# EAGLE design Printhead_board (EAGLE 9.3.0)
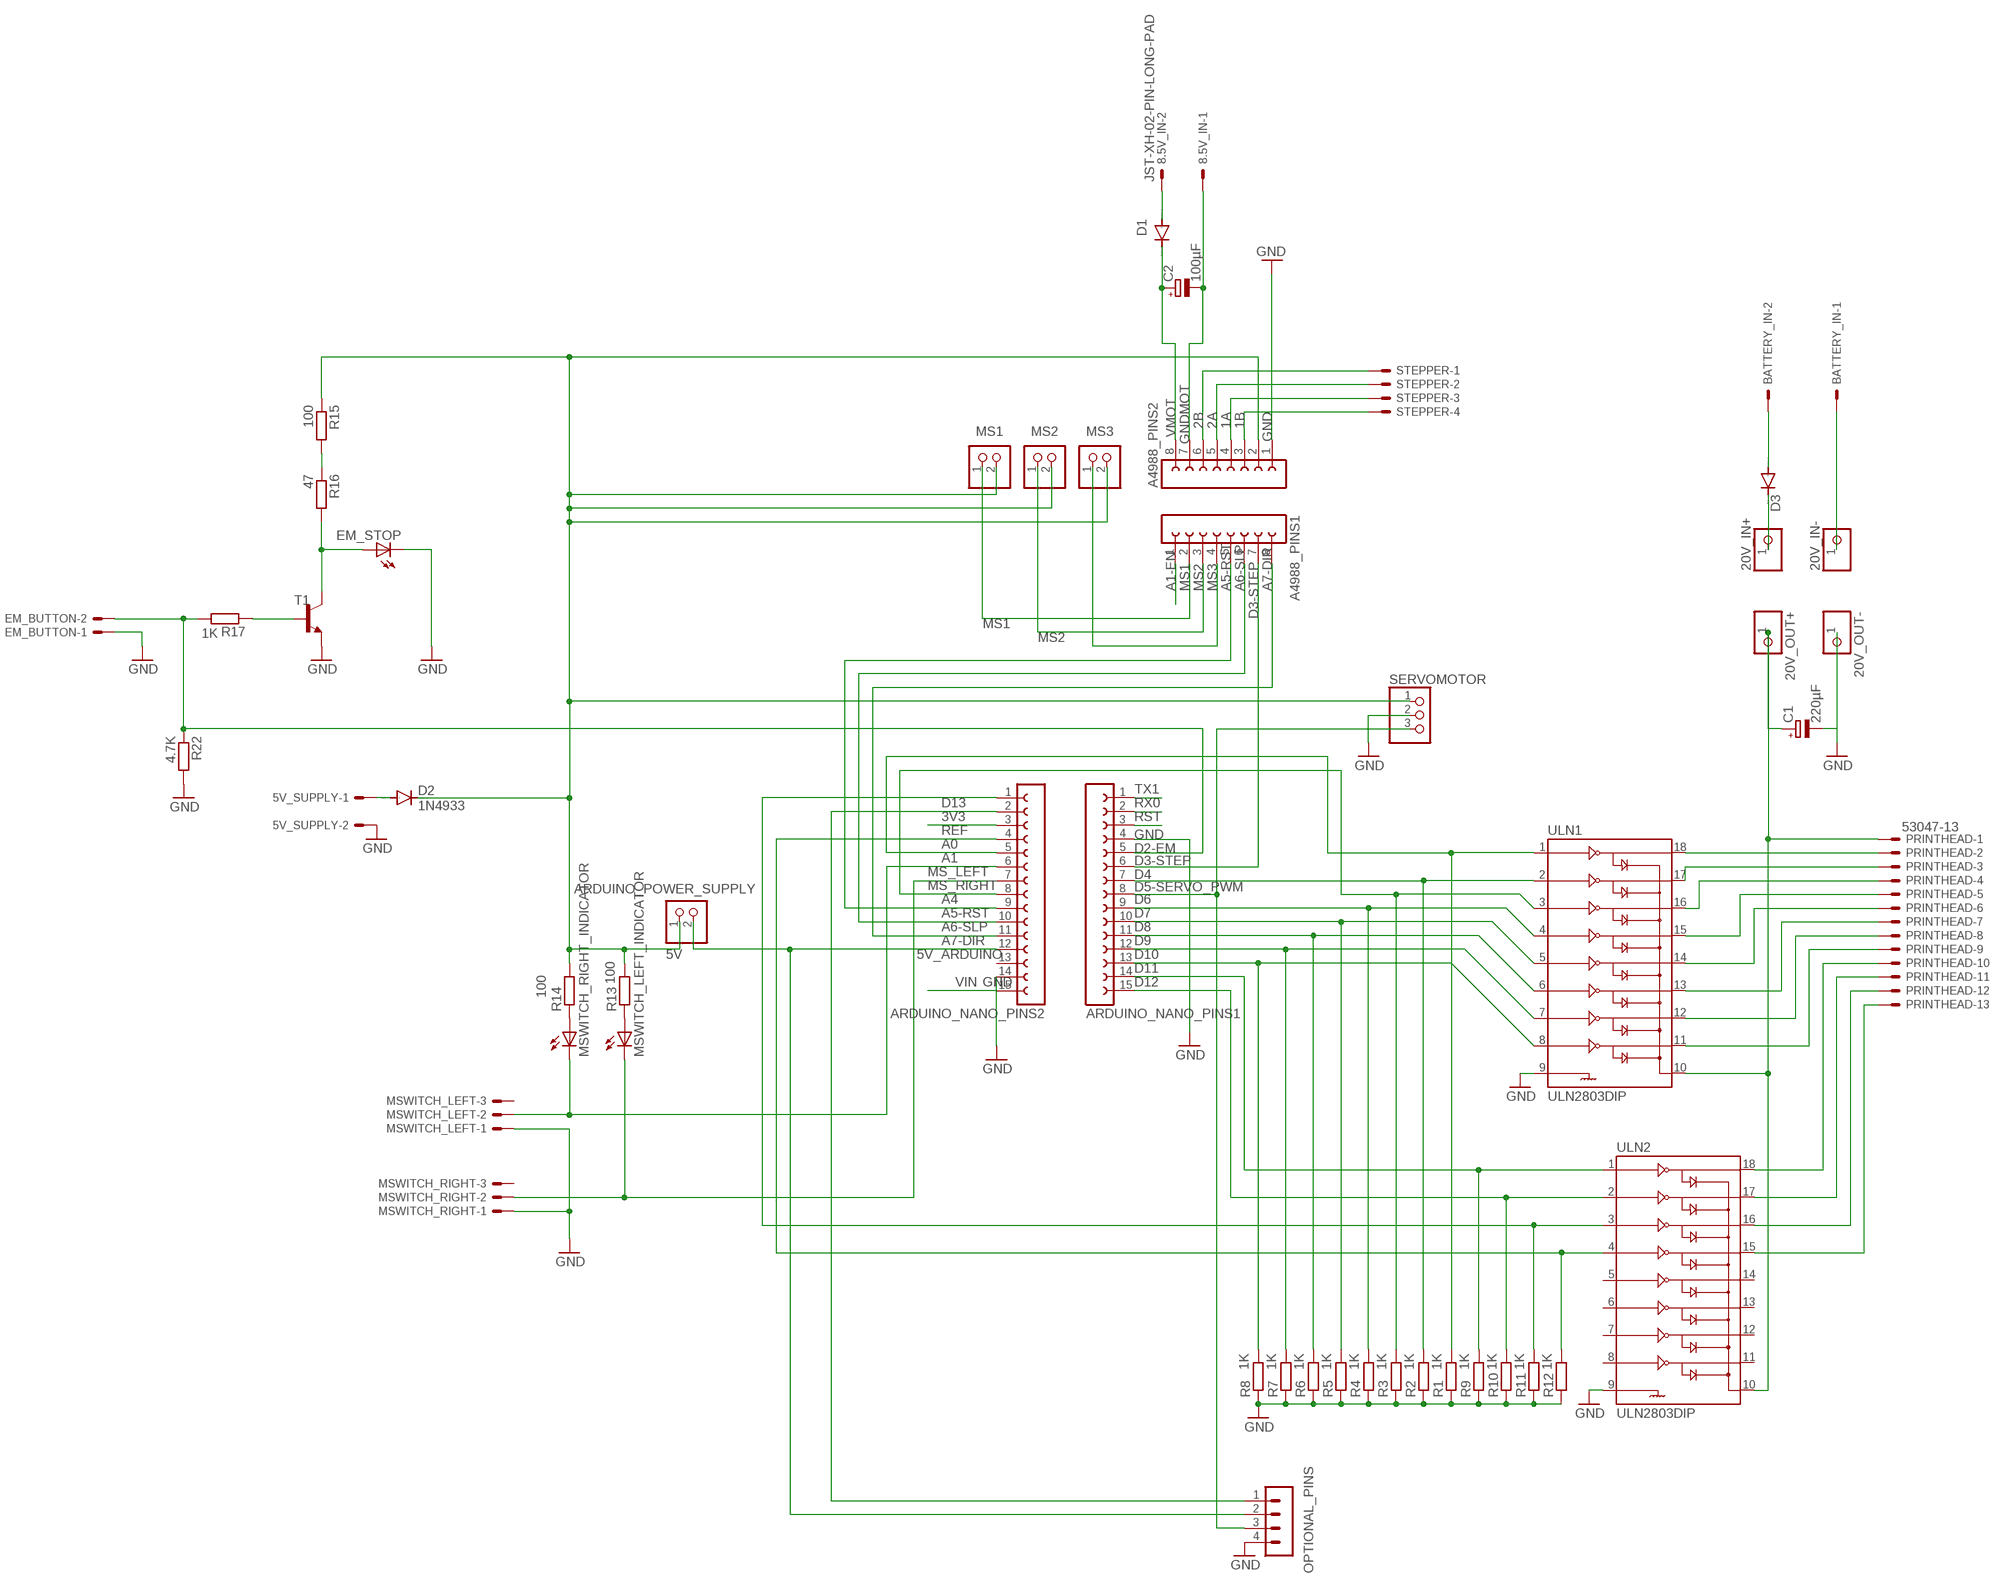
[diagram p0: schematic, sheet 1]

## Parts
5V_SUPPLY  JST-XH-02-PIN-LONG-PAD  [JST-XH-02-PACKAGE-LONG-PAD]
8.5V_IN  JST-XH-02-PIN-LONG-PAD  [JST-XH-02-PACKAGE-LONG-PAD]
20V_IN+  PINHD-1X1  [1X01]
20V_IN-  PINHD-1X1  [1X01]
20V_OUT+  PINHD-1X1  [1X01]
20V_OUT-  PINHD-1X1  [1X01]
A4988_PINS1  FE08-1  [FE08]
A4988_PINS2  FE08-1  [FE08]
ARDUINO_NANO_PINS1  FE15-1  [FE15]
ARDUINO_NANO_PINS2  FE15-1  [FE15]
ARDUINO_POWER_SUPPLY  PINHD-1X2  [1X02]
BATTERY_IN  JST-XH-02-PIN-ROUND-PAD  [JST-XH-02-PACKAGE-ROUND-PAD]
C1  220µF  CPOL-EUE5-10.5  [E5-10,5]
C2  100µF  CPOL-EUSANYO_E  [SANYO-OSCON_E]
D1  DIODE-DO15-12  [DO15-12]
D2  1N4933  [DO41-10]
D3  DIODE-DO201-15  [DO201-15]
EM_BUTTON  JST-XH-02-PIN-LONG-PAD  [JST-XH-02-PACKAGE-LONG-PAD]
EM_STOP  LED5MM  [LED5MM]
MS1  PINHD-1X2  [1X02]
MS2  PINHD-1X2  [1X02]
MS3  PINHD-1X2  [1X02]
MSWITCH_LEFT  JST-XH-03-PIN-LONG-PAD  [JST-XH-03-PACKAGE-LONG-PAD]
MSWITCH_LEFT_INDICATOR  LED5MM  [LED5MM]
MSWITCH_RIGHT  JST-XH-03-PIN-LONG-PAD  [JST-XH-03-PACKAGE-LONG-PAD]
MSWITCH_RIGHT_INDICATOR  LED5MM  [LED5MM]
OPTIONAL_PINS  MA04-1  [MA04-1]
PRINTHEAD  53047-13  [53047-13]
R1  1K  R-EU_0207/7  [0207/7]
R2  1K  R-EU_0207/7  [0207/7]
R3  1K  R-EU_0207/7  [0207/7]
R4  1K  R-EU_0207/7  [0207/7]
R5  1K  R-EU_0207/7  [0207/7]
R6  1K  R-EU_0207/7  [0207/7]
R7  1K  R-EU_0207/7  [0207/7]
R8  1K  R-EU_0207/7  [0207/7]
R9  1K  R-EU_0207/7  [0207/7]
R10  1K  R-EU_0207/7  [0207/7]
R11  1K  R-EU_0207/7  [0207/7]
R12  1K  R-EU_0207/7  [0207/7]
R13  100  R-EU_0207/7  [0207/7]
R14  100  R-EU_0207/7  [0207/7]
R15  100  R-EU_0207/7  [0207/7]
R16  47  R-EU_0207/7  [0207/7]
R17  1K  R-EU_0207/7  [0207/7]
R22  4.7K  R-EU_0207/7  [0207/7]
SERVOMOTOR  PINHD-1X3  [1X03]
STEPPER  JST-XH-04-PIN-LONG-PAD  [JST-XH-04-PACKAGE-LONG-PAD]
T1  2N2222  [TO92-EBC-OVAL]
ULN1  ULN2803DIP  [DIL18]
ULN2  ULN2803DIP  [DIL18]

## Nets
1A: A4988_PINS2.4 STEPPER.3
1B: A4988_PINS2.3 STEPPER.4
2A: A4988_PINS2.5 STEPPER.2
2B: A4988_PINS2.6 STEPPER.1
3V3: ARDUINO_NANO_PINS2.2 OPTIONAL_PINS.1
5V: A4988_PINS2.2 ARDUINO_POWER_SUPPLY.1 D2.C MS1.2 MS2.2 MS3.2 R13.2 R14.2 R15.1 SERVOMOTOR.1
5V_ARDUINO: ARDUINO_NANO_PINS2.12 ARDUINO_POWER_SUPPLY.2 OPTIONAL_PINS.2
A0: ARDUINO_NANO_PINS2.4 R12.2 ULN2.4
A1: ARDUINO_NANO_PINS2.5 R1.2 ULN1.1
A1-EN: A4988_PINS1.1
A4: ARDUINO_NANO_PINS2.8 R3.2 ULN1.3
A5-RST: A4988_PINS1.5 ARDUINO_NANO_PINS2.9
A6-SLP: A4988_PINS1.6 ARDUINO_NANO_PINS2.10
A7-DIR: A4988_PINS1.8 ARDUINO_NANO_PINS2.11
D2-EM: ARDUINO_NANO_PINS1.5 EM_BUTTON.2 R17.2 R22.1
D3-STEP: A4988_PINS1.7 ARDUINO_NANO_PINS1.6
D4: ARDUINO_NANO_PINS1.7 R2.2 ULN1.2
D5-SERVO_PWM: ARDUINO_NANO_PINS1.8 OPTIONAL_PINS.3 SERVOMOTOR.3
D6: ARDUINO_NANO_PINS1.9 R4.2 ULN1.4
D7: ARDUINO_NANO_PINS1.10 R5.2 ULN1.5
D8: ARDUINO_NANO_PINS1.11 R6.2 ULN1.6
D9: ARDUINO_NANO_PINS1.12 R7.2 ULN1.7
D10: ARDUINO_NANO_PINS1.13 R8.2 ULN1.8
D11: ARDUINO_NANO_PINS1.14 R9.2 ULN2.1
D12: ARDUINO_NANO_PINS1.15 R10.2 ULN2.2
D13: ARDUINO_NANO_PINS2.1 R11.2 ULN2.3
GND: 5V_SUPPLY.2 20V_OUT-.1 A4988_PINS2.1 ARDUINO_NANO_PINS1.4 ARDUINO_NANO_PINS2.14 C1.- EM_BUTTON.1 EM_STOP.K(C) MSWITCH_LEFT.1 MSWITCH_RIGHT.1 OPTIONAL_PINS.4 R1.1 R2.1 R3.1 R4.1 R5.1 R6.1 R7.1 R8.1 R9.1 R10.1 R11.1 R12.1 R22.2 SERVOMOTOR.2 T1.E ULN1.9 ULN2.9
GNDMOT [Large]: 8.5V_IN.1 A4988_PINS2.7 C2.-
MS1: A4988_PINS1.2 MS1.1
MS2: A4988_PINS1.3 MS2.1
MS3: A4988_PINS1.4 MS3.1
MS_LEFT: ARDUINO_NANO_PINS2.6 MSWITCH_LEFT.2 MSWITCH_RIGHT_INDICATOR.K(C)
MS_RIGHT: ARDUINO_NANO_PINS2.7 MSWITCH_LEFT_INDICATOR.K(C) MSWITCH_RIGHT.2
N1: PRINTHEAD.2 ULN1.18
N12: PRINTHEAD.13 ULN2.15
N$2: EM_STOP.A R16.2 T1.C
N$3: R17.1 T1.B
N$9: R15.2 R16.1
N$13 [VryLarge]: BATTERY_IN.2 D3.A
N$17: 5V_SUPPLY.1 D2.A
N$18: PRINTHEAD.3 ULN1.17
N$19: PRINTHEAD.4 ULN1.16
N$20: PRINTHEAD.5 ULN1.15
N$21: PRINTHEAD.6 ULN1.14
N$22: PRINTHEAD.7 ULN1.13
N$23: PRINTHEAD.8 ULN1.12
N$24: PRINTHEAD.9 ULN1.11
N$25: PRINTHEAD.10 ULN2.18
N$26: PRINTHEAD.11 ULN2.17
N$27: PRINTHEAD.12 ULN2.16
N$28 [Large]: 8.5V_IN.2 D1.A
N$29: MSWITCH_LEFT_INDICATOR.A R13.1
N$30: MSWITCH_RIGHT_INDICATOR.A R14.1
N$31 [VryLarge]: 20V_IN-.1 BATTERY_IN.1
N$32: 20V_OUT+.1 C1.+ PRINTHEAD.1 ULN1.10 ULN2.10
N$33 [VryLarge]: 20V_IN+.1 D3.C
REF: ARDUINO_NANO_PINS2.3
RST: ARDUINO_NANO_PINS1.3
RX0: ARDUINO_NANO_PINS1.2
TX1: ARDUINO_NANO_PINS1.1
VIN: ARDUINO_NANO_PINS2.15
VMOT [Large]: A4988_PINS2.8 C2.+ D1.C
Unconnected: ARDUINO_NANO_PINS2.13 MSWITCH_LEFT.3 MSWITCH_RIGHT.3 ULN2.5 ULN2.6 ULN2.7 ULN2.8 ULN2.11 ULN2.12 ULN2.13 ULN2.14

## Library data of the parts
5V_SUPPLY 8.5V_IN BATTERY_IN EM_BUTTON = Rembrandt Electronics - JST XH Connectors v1-0:JST-XH-02-PIN: JST XH Connector 2 Pin Wire to board connector. Pitch: 2,54 mm, (0.100") Number of pins: 2 Created by Rembrandt Electronics www.rembrandtelectronics.com
20V_IN+ 20V_IN- 20V_OUT+ 20V_OUT- = adafruit:PINHD-1X1: Pin header 1x1 for 0.1" spacing With round pins
A4988_PINS1 A4988_PINS2 = con-lsta:FE08-1: FEMALE HEADER; OC_FARNELL: unknown; OC_NEWARK: unknown
ARDUINO_NANO_PINS1 ARDUINO_NANO_PINS2 = con-lsta:FE15-1: FEMALE HEADER; OC_FARNELL: unknown; OC_NEWARK: unknown
ARDUINO_POWER_SUPPLY MS1-MS3 = pinhead:PINHD-1X2: PIN HEADER
C1 C2 = rcl:CPOL-EU: POLARIZED CAPACITOR, European symbol; SPICEPREFIX: C
D1 D3 = diode:DIODE-: DIODE
D2 = diode:1N4933: DIODE fast recovery rectifier, 1A
EM_STOP MSWITCH_LEFT_INDICATOR MSWITCH_RIGHT_INDICATOR = adafruit:LED: LED OSRAM: - CHIPLED LG R971, LG N971, LY N971, LG Q971, LY Q971, LO R971, LY R971 LH N974, LH R974 LS Q976, LO Q976, LY Q976 LO Q996 - Hyper CHIPLED LW Q18S LB Q993, LB Q99A, LB R99A - SideLED LS A670, LO A670, LY A670, LG A670, LP A670 LB A673, LV A673, LT A673, LW A673 LH A674 LY A675 LS A676, LA A676, LO A676, LY A676, LW A676 LS A679, LY A679, LG A679 - Hyper Micro SIDELED® LS Y876, LA Y876, LO Y876, LY Y876 LT Y87S - SmartLED LW L88C, LW L88S LB L89C, LB L89S, LG L890 LS L89K, LO L89K, LY L89K LS L896, LA L896, LO L896, LY L896 - TOPLED LS T670, LO T670, LY T670, LG T670, LP T670 LSG T670, LSP T670, LSY T670, LOP T670, LYG T670 LG T671, LOG T671, LSG T671 LB T673, LV T673, LT T673, LW T673 LH T674 LS T676, LA T676, LO T676, LY T676, LB T676, LH T676, LSB T676, LW T676 LB T67C, LV T67C, LT T67C, LS T67K, LO T67K, LY T67K, LW E67C LS E67B, LA E67B, LO E67B, LY E67B, LB E67C, LV E67C, LT E67C LW T67C LS T679, LY T679, LG T679 LS T770, LO T770, LY T770, LG T770, LP T770 LB T773, LV T773, LT T773, LW T773 LH T774 LS E675, LA E675, LY E675, LS T675 LS T776, LA T776, LO T776, LY T776, LB T776 LHGB T686 LT T68C, LB T68C - Hyper Mini TOPLED® LB M676 - Mini TOPLED Santana® LG M470 LS M47K, LO M47K, LY M47K Source: http://www.osram.convergy.de/
MSWITCH_LEFT MSWITCH_RIGHT = Rembrandt Electronics - JST XH Connectors v1-0:JST-XH-03-PIN: JST XH Connector 2 Pin Wire to board connector. Pitch: 2,54 mm, (0.100") Number of pins: 3 Created by Rembrandt Electronics www.rembrandtelectronics.com
OPTIONAL_PINS = con-lstb:MA04-1: PIN HEADER; OC_FARNELL: unknown; OC_NEWARK: unknown
PRINTHEAD = con-molex:53?-13: CONNECTOR wire to board 1.25 mm (.049 inch) pitch header; MF: MOLEX; MPN: 53047-1310-C; OC_FARNELL: 1012238; OC_NEWARK: 03N7646
R1-R17 R22 = rcl:R-EU_: RESISTOR, European symbol; SPICEPREFIX: R
SERVOMOTOR = adafruit:PINHD-1X3: PIN HEADER
STEPPER = Rembrandt Electronics - JST XH Connectors v1-0:JST-XH-04-PIN: JST XH Connector 2 Pin Wire to board connector. Pitch: 2,54 mm, (0.100") Number of pins: 4 Created by Rembrandt Electronics www.rembrandtelectronics.com
T1 = adafruit:2N2222: NPN TRANSISTOR Big oval pads
ULN1 ULN2 = uln2803:ULN2803: Darlington Driver(IC-07959, low stock) ULN2803 Darlington array. 500mA max per channel, 8-channel package. Spark Fun Electronics SKU : COM-00312; AVAILABILITY: Unavailable; MF: STMicroelectronics; MP: ULN2803; PACKAGE: DIP-18 STMicroelectronics; PRICE: None

## Net classes
0 1B: width 0.3 mm
1 Large: width 1 mm, drill 0.65 mm
2 VryLarge: width 1.5 mm, drill 0.8 mm

## Board
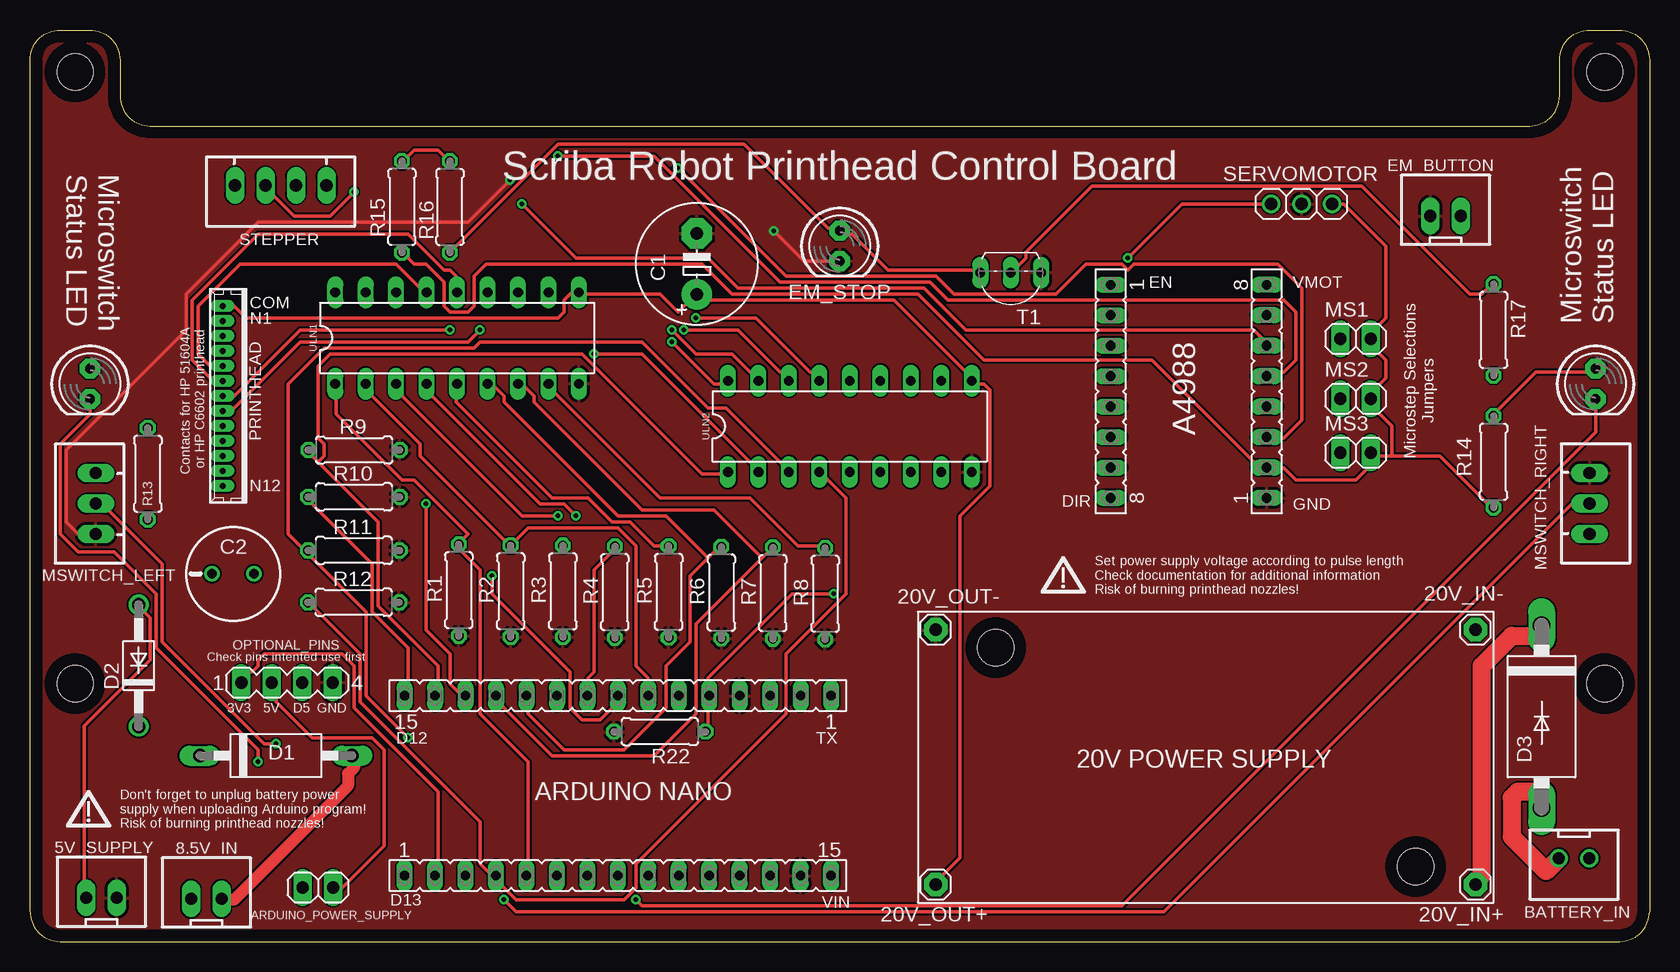
[diagram p1: board, top side]
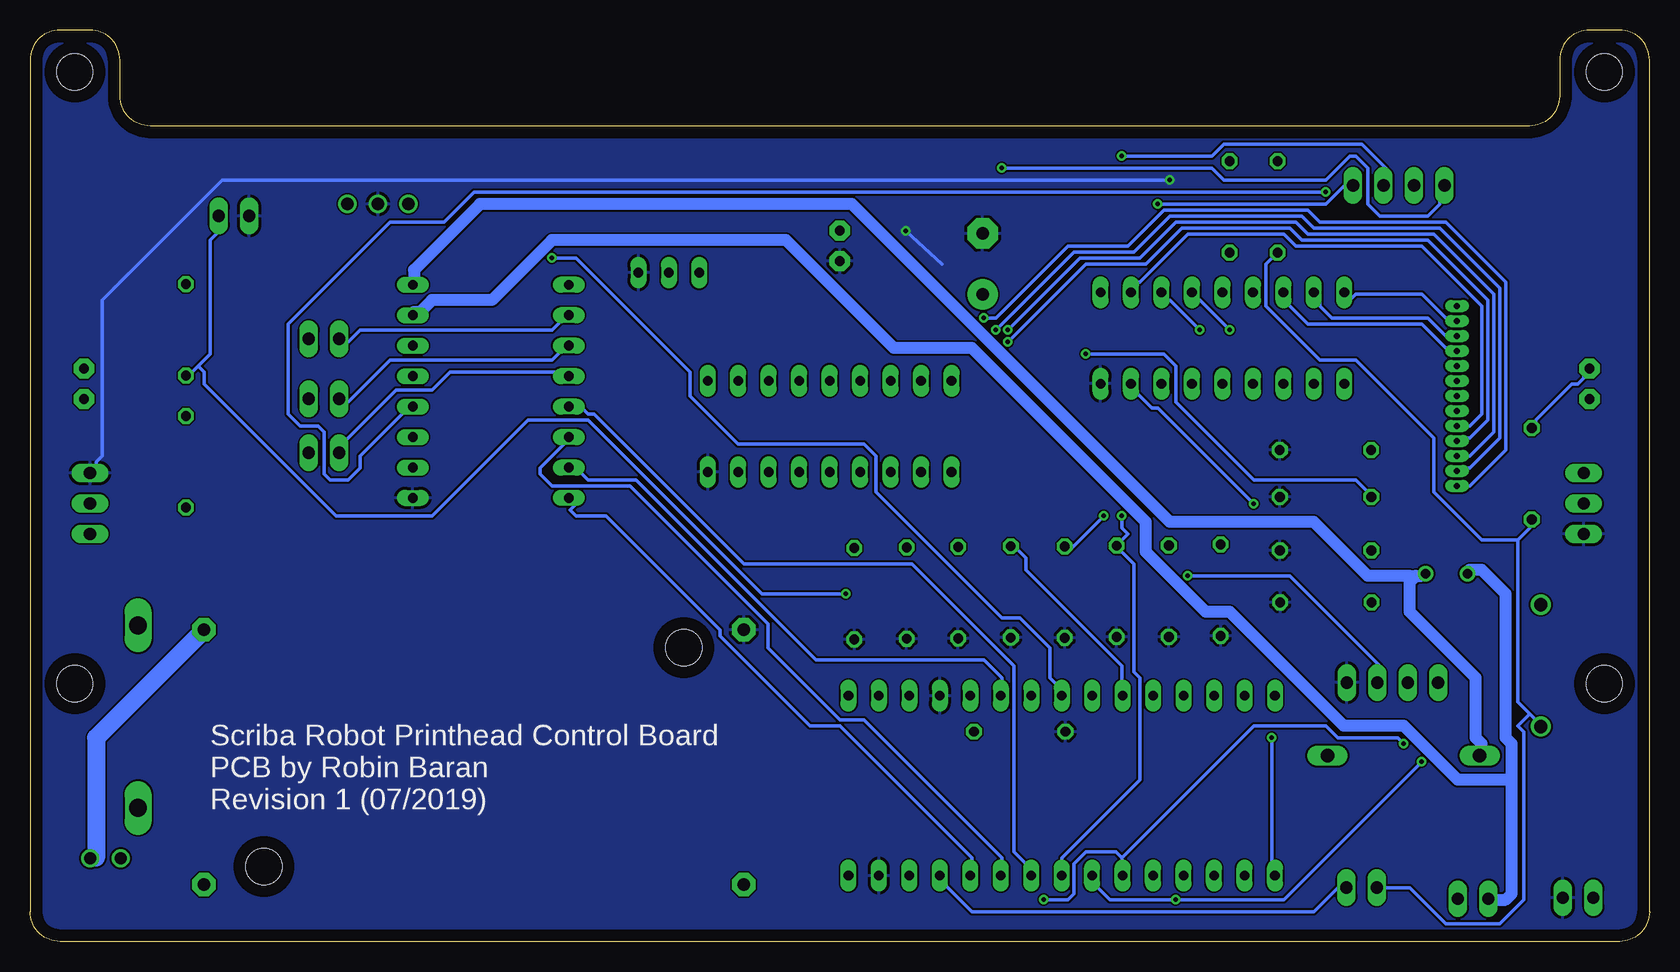
[diagram p2: board, bottom side, seen from below]

Size 135 x 76 mm. Coordinates in mm from the lower left corner, seen from the top.
Outline: 0,2.5 0,73.5 arc-90 2.5,76 5,76 arc-90 7.5,73.5 7.5,70.5 arc90 10,68 125,68 arc90 127.5,70.5 127.5,73.5 arc-90 130,76 132.5,76 arc-90 135,73.5 135,2.5 arc-90 132.5,0 2.5,0 arc-90 0,2.5
Copper layers (1*16): Top 0.035mm / dielectric 1.5mm / Bottom 0.035mm
Design rules "default": minimum track width 6mil, minimum drill 0.35mm, track to track 6mil, track to pad 6mil, pad to pad 6mil, via to via 6mil, smd to smd 6mil, copper to edge 40mil, drill to drill 6mil, minimum pad ring 10mil, minimum via ring 8mil, stop-mask expansion 4mil, vias tented up to drill 0mil, thermal gap 10mil
Holes 3 mm at 115.5,6.25 80.5,24.5 3.76,72.5 3.76,21.5 131.26,72.5 131.26,21.5

### Footprints (pad centres in the part's own frame; a part is rotated, then mirrored left to right if it is on the bottom)
JST-XH-02-PACKAGE-LONG-PAD = drill 1.016 long: 1 -1.27,0; 2 1.27,0
1X01 = drill 1.016 pad 1.93 octagon: 1 0,0
FE08 = drill 0.813 long: 1 -8.89,0; 2 -6.35,0; 3 -3.81,0; 4 -1.27,0; 5 1.27,0; 6 3.81,0; 7 6.35,0; 8 8.89,0
FE15 = drill 0.813 long: 1 -17.78,0; 2 -15.24,0; 3 -12.7,0; 4 -10.16,0; 5 -7.62,0; 6 -5.08,0; 7 -2.54,0; 8 0,0; 9 2.54,0; 10 5.08,0; 11 7.62,0; 12 10.16,0; 13 12.7,0; 14 15.24,0; 15 17.78,0
1X02 = drill 1.016 long: 1 -1.27,0; 2 1.27,0
JST-XH-02-PACKAGE-ROUND-PAD = drill 1.016: 1 -1.27,0; 2 1.27,0
E5-10,5 = drill 1.016 pad 2.54: + -2.54,0 | drill 1.016 pad 2.54 octagon: - 2.54,0
SANYO-OSCON_E = drill 0.8 pad 1.27: + 1.75,0; - -1.75,0
DO15-12 = drill 1.118 long: A 6.35,0; C -6.35,0
DO41-10 = drill 1.118: A 5.08,0; C -5.08,0
DO201-15 = drill 1.499 long: A 7.62,0; C -7.62,0
LED5MM = drill 0.813 pad 1.676 octagon: A -1.27,0; K 1.27,0
JST-XH-03-PACKAGE-LONG-PAD = drill 1.016 long: 1 -2.54,0; 2 0,0; 3 2.54,0
MA04-1 = drill 1.016 long: 1 -3.81,0; 2 -1.27,0; 3 1.27,0; 4 3.81,0
53047-13 = drill 0.5 pad 0.698 long: 1 7.5,0.45; 2 6.25,0.45; 3 5,0.45; 4 3.75,0.45; 5 2.5,0.45; 6 1.25,0.45; 7 0,0.45; 8 -1.25,0.45; 9 -2.5,0.45; 10 -3.75,0.45; 11 -5,0.45; 12 -6.25,0.45; 13 -7.5,0.45
0207/7 = drill 0.813 octagon: 1 -3.81,0; 2 3.81,0
1X03 = drill 1.016: 1 -2.54,0; 2 0,0; 3 2.54,0
JST-XH-04-PACKAGE-LONG-PAD = drill 1.016 long: 1 -3.81,0; 2 -1.27,0; 3 1.27,0; 4 3.81,0
TO92-EBC-OVAL = drill 0.813 long: B 0,-1.27; C 2.54,-1.27; E -2.54,-1.27
DIL18 = drill 0.813 long: 1 -10.16,-3.81; 2 -7.62,-3.81; 3 -5.08,-3.81; 4 -2.54,-3.81; 5 0,-3.81; 6 2.54,-3.81; 7 5.08,-3.81; 8 7.62,-3.81; 9 10.16,-3.81; 10 10.16,3.81; 11 7.62,3.81; 12 5.08,3.81; 13 2.54,3.81; 14 0,3.81; 15 -2.54,3.81; 16 -5.08,3.81; 17 -7.62,3.81; 18 -10.16,3.81

### Placement (x,y rotation side)
5V_SUPPLY  5.95,3.64 0 top
8.5V_IN  14.7,3.57 0 top
20V_IN+  120.5,4.75 180 top
20V_IN-  120.5,26 180 top
20V_OUT+  75.5,4.75 180 top
20V_OUT-  75.5,26 180 top
A4988_PINS1  90.09,45.87 270 top
A4988_PINS2  103.09,45.87 90 top
ARDUINO_NANO_PINS1  49,20.5 180 top
ARDUINO_NANO_PINS2  49,5.5 0 top
ARDUINO_POWER_SUPPLY  24,4.5 0 top
BATTERY_IN  128.71,6.93 180 top
C1  55.59,56.5 90 top
C2  16.92,30.66 0 top
D1  20.5,15.5 0 top
D2  9.06,23 90 top
D3  126,18.75 270 top
EM_BUTTON  118,60.5 0 top
EM_STOP  67.5,58 270 top
MS1  110.5,50.25 0 top
MS2  110.5,45.25 0 top
MS3  110.5,40.75 0 top
MSWITCH_LEFT  5.49,36.51 90 top
MSWITCH_LEFT_INDICATOR  5,46.5 270 top
MSWITCH_RIGHT  130,36.53 270 top
MSWITCH_RIGHT_INDICATOR  130.5,46.5 270 top
OPTIONAL_PINS  21.43,21.58 0 top
PRINTHEAD  16.5,45.5 90 top
R1  35.74,29.3 90 top
R2  40.07,29.21 90 top
R3  44.42,29.2 90 top
R4  48.75,29.13 90 top
R5  53.24,29.15 90 top
R6  57.63,29.09 90 top
R7  61.92,29.05 90 top
R8  66.29,28.99 90 top
R9  27.02,40.98 180 top
R10  27.01,37.07 180 top
R11  27,32.61 180 top
R12  26.98,28.28 180 top
R13  9.82,39 270 top
R14  122,40 270 top
R15  31,61.25 90 top
R16  35,61.25 270 top
R17  122,51 270 top
R22  52.5,17.5 180 top
SERVOMOTOR  106,61.5 180 top
STEPPER  20.9,63.04 180 top
T1  81.75,54.5 180 top
ULN1  35.6,50.32 0 top
ULN2  68.34,42.95 0 top

### Tracks (layer width: path | path; a pad name or v marks a point on that pad's centre or on a via)
1A  (via drill 0.35)
  Top 0.3: v27,62.5 25,60.5 22,60.5 19.5,63 STEPPER.3
  Bottom 0.3: v27,62.5 98,62.5 100.5,60 105,60 113.5,51.5 113.5,44 112.5,43 111,43 110.5,42.5 110.5,39 110,38.5 108.5,38.5 107.5,39.5 107.5,40.5 103.5,44.5 A4988_PINS2.4
1B  (via drill 0.35)
  Top 0.3: v54,64.5 63,55.5 75.5,55.5 77,54 85.5,54 88,56.5 91,56.5 91.5,56 92,56.5 104,56.5 106,54.5 106,43.5 104.5,42 103.5,42 A4988_PINS2.3
  Bottom 0.3: v54,64.5 36.5,64.5 35.5,63.5 27,63.5 25,65.5 24.5,65.5 23.5,64.5 23.5,61.5 22.5,60.5 18.5,60.5 17.5,61.5 17.5,63 STEPPER.4
2A  (via drill 0.35)
  Top 0.3: v44,65.5 52,65.5 62.5,55 75,55 76.5,53.5 104.5,53.5 105.5,52.5 105.5,48.5 104.5,47.5 103.5,47.5 A4988_PINS2.5
  Bottom 0.3: v44,65.5 36.5,65.5 35.5,66.5 24,66.5 22,64.5 22,63.5 STEPPER.2
2B  (via drill 0.35)
  Top 0.3: v41,61.5 45.5,57 56.5,57 59,54.5 74.5,54.5 78,51 102,51 103,50 A4988_PINS2.6
  Bottom 0.3: v41,61.5 27,61.5 25,63.5 STEPPER.1
3V3
  Top 0.3: ARDUINO_NANO_PINS2.2 34,5.5 34,12.5 27,19.5 27,23 26,24 19.5,24 19,23.5 19,23 18.5,22.5 18,22.5 17.5,22 OPTIONAL_PINS.1
5V
  Top 0.3: 111.5,39.5 110.5,38.5 105.5,38.5 104.5,39.5 103.5,39.5 A4988_PINS2.2 103,40 102,40 93.5,48.5 79.5,48.5 74,54 58.5,54 56,56.5 38,56.5 37,55.5 37,53 36.5,52.5 35,52.5 34.5,53 34.5,55 33,56.5 32,56.5 31.5,57 31.5,57.5 31,57.5 R15.1 | 111.5,39.5 111.5,40.5 MS3.2 111.5,39.5 | 113.5,40.5 112.5,40.5 111.5,39.5 | 113.5,40.5 117.5,40.5 121.5,36.5 122,36.5 R14.2 | 113.5,40.5 113.5,43 112,44.5 112,45 MS2.2 111.5,45.5 113,47 113,48.5 112,49.5 112,50 MS1.2 111.5,50.5 113,52 113,58 109.5,61.5 SERVOMOTOR.1
  Bottom 0.3: 11,33.5 10,34.5 10,35 R13.2 | 11,33.5 11,20 10,19 | 10,19 9.5,18.5 9,18.5 9,18 D2.C | 11,33.5 14,33.5 18,37.5 18,42 24.5,48.5 27.5,48.5 32,53 32,56.5 31.5,57 31,57 R15.1 | ARDUINO_POWER_SUPPLY.1 20,4.5 17,1.5 12.5,1.5 10.5,3.5 10.5,17.5 11,18 10,19
5V_ARDUINO
  Top 0.3: OPTIONAL_PINS.2 20.5,21.5 20.5,20 23.5,17 28.5,17 29.5,16 29.5,8 25.5,4 25,4.5 ARDUINO_POWER_SUPPLY.2
  Bottom 0.3: ARDUINO_NANO_PINS2.12 59,5.5 59,5 56.5,2.5 28,2.5 25.5,5 25,4.5 ARDUINO_POWER_SUPPLY.2
A0
  Top 0.3: 38.5,5.5 37.5,6.5 37.5,10 27.5,20 27.5,24 23.5,28 R12.2 | 38.5,5.5 40.5,3.5 49.5,3.5 50.5,4.5 50.5,6.5 63,19 63,24 68,29 68,37 66,39 ULN2.4 | 38.5,5.5 ARDUINO_NANO_PINS2.4
A1
  Top 0.3: ARDUINO_NANO_PINS2.5 41.5,5.5 41.5,15 37.5,19 37.5,31 35.5,33 R1.2 36,33.5 36.5,34 32,38.5 31,38.5 25.5,44 25.5,46.5 ULN1.1
A4  (via drill 0.35)
  Top 0.3: v44,35.5 41,35.5 31,45.5 31,46.5 ULN1.3
  Bottom 0.3: ARDUINO_NANO_PINS2.8 49,7 42.5,13.5 42.5,22 43,22.5 43,31.5 44,32.5 44.5,32.5 44.5,33 R3.2 44,33.5 43.5,34 44,34.5 v44,35.5
A5-RST
  Bottom 0.3: ARDUINO_NANO_PINS2.9 52,5.5 52,6.5 53,7.5 53,23 61.5,31.5 75.5,31.5 88,44 88.5,44 89,44.5 90,44.5 A4988_PINS1.5
A6-SLP
  Bottom 0.3: ARDUINO_NANO_PINS2.10 54,5.5 54,7 65.5,18.5 67.5,18.5 73.5,24.5 73.5,26.5 85,38 91.5,38 92.5,39 92.5,39.5 90,42 A4988_PINS1.6
A7-DIR
  Bottom 0.3: ARDUINO_NANO_PINS2.11 56.5,5.5 56.5,7 67.5,18 70,18 77.5,25.5 77.5,26 87,35.5 89.5,35.5 90,36 89.5,36.5 90,37 A4988_PINS1.8
D2-EM  (via drill 0.35)
  Top 0.3: 56.5,20.5 56.5,17.5 R22.1 | 56.5,20.5 56.5,22 63.5,29 v67,29 | 56.5,20.5 ARDUINO_NANO_PINS1.5
  Bottom 0.3: 121,48 120,49 120,58.5 119.5,59 119.5,60.5 EM_BUTTON.2 | 121,48 121.5,47.5 122,47.5 R17.2 | v67,29 74,29 88.5,43.5 93.5,43.5 101.5,35.5 109.5,35.5 120.5,46.5 120.5,47.5 121,48
D3-STEP
  Bottom 0.3: ARDUINO_NANO_PINS1.6 54,20.5 54,22 55.5,23.5 69.5,23.5 84.5,38.5 88.5,38.5 90,40 A4988_PINS1.7
D4
  Top 0.3: ULN1.2 27.5,46.5 32.5,41.5 32.5,40.5 39.5,33.5 40,33.5 R2.2 40.5,33.5 41.5,34.5 49,34.5 50.5,33 50.5,23 51.5,22 51.5,20.5 ARDUINO_NANO_PINS1.7
D5-SERVO_PWM  (via drill 0.35)
  Top 0.3: ARDUINO_NANO_PINS1.8 49,20 47.5,18.5 46,18.5 45,19.5 45,22.5 38.5,29 v38.5,30.5 | SERVOMOTOR.3 96,61.5 v91.5,57
  Bottom 0.3: v38.5,30.5 30,30.5 22.5,23 22.5,22 OPTIONAL_PINS.3 | v91.5,57 89.5,57 80,47.5 80,45.5 76,41.5 65.5,41.5 64.5,40.5 64.5,37.5 54,27 52.5,27 50,24.5 50,22 49,21 ARDUINO_NANO_PINS1.8
D6  (via drill 0.35)
  Top 0.3: ARDUINO_NANO_PINS1.9 46.5,20.5 46.5,22 47,22.5 47,31 48.5,32.5 R4.2 | v45.5,35.5 44.5,36.5 42.5,36.5 33.5,45.5 33.5,46.5 ULN1.4
  Bottom 0.3: v45.5,35.5 48.5,32.5 R4.2
D7
  Top 0.3: ULN1.5 35.5,46.5 35.5,45 43.5,37 46.5,37 48.5,35 50,35 52,33 53,33 R5.2
  Bottom 0.3: ARDUINO_NANO_PINS1.10 44,20.5 44,23 52,31 52,32 53,33 R5.2
D8
  Top 0.3: 56.5,32 57.5,33 R6.2 | 56.5,32 55,30.5 55,25 53,23 53,19.5 49.5,16 44.5,16 41.5,19 41.5,20.5 ARDUINO_NANO_PINS1.11 | 56.5,32 53,35.5 49,35.5 39.5,45 39.5,45.5 38.5,46.5 ULN1.6
D9
  Top 0.3: 61,32 61.5,32.5 R7.2 | 61,32 55.5,26.5 55.5,19 52,15.5 43.5,15.5 39,20 39,20.5 ARDUINO_NANO_PINS1.12 | 61,32 57,36 51,36 42,45 42,45.5 41,46.5 ULN1.7
D10  (via drill 0.35)
  Top 0.3: v33,36.5 33,26 35,24 35,21.5 36,20.5 ARDUINO_NANO_PINS1.13 | R8.2 66,33 64,33 60,37 52.5,37 43,46.5 ULN1.8
  Bottom 0.3: v33,36.5 41,44.5 41.5,44.5 43.5,46.5 ULN1.8
D11
  Top 0.3: 24,40 23.5,40.5 R9.2 | 24,40 29,35 29,28 34,23 34,20.5 ARDUINO_NANO_PINS1.14 | 24,40 24.5,40.5 24.5,41.5 24,42 24,48 25,49 46,49 56,39 58,39 ULN2.1
D12  (via drill 0.35)
  Top 0.3: ARDUINO_NANO_PINS1.15 31.5,20.5 31.5,24.5 28.5,27.5 28.5,31.5 23,37 R10.2 | v47,49 51,49 60.5,39.5 ULN2.2
  Bottom 0.3: v47,49 40.5,49 39.5,48 39.5,45 33,38.5 24.5,38.5 23.5,37.5 R10.2
D13  (via drill 0.35)
  Top 0.3: v31.5,17 28,20.5 28,27.5 23,32.5 | 23,32.5 21.5,34 21.5,46.5 24.5,49.5 37,49.5 37.5,50 51,50 56.5,44.5 58,44.5 63,39.5 ULN2.3 | 23,32.5 R11.2
  Bottom 0.3: v31.5,17 31.5,5.5 ARDUINO_NANO_PINS2.1
GND  (via drill 0.35)
  Top 0.3: v40,63.5 36.5,60 19,60 13,54 13,51 3,41 3,35 4,34 5,34 MSWITCH_LEFT.1 | EM_STOP.K 64.5,56.75 v62,59.25
  Bottom 0.3: v40,63.5 119,63.5 129,53.5 129,40.5 129.5,40 129.5,39.5 130,39 MSWITCH_RIGHT.1 | v62,59.25 59,56.5
  pour Top: -1.5,77.5 136.5,77.5 136.5,-1.5 -1.5,-1.5
  pour Bottom: -1.39,77.5 136.5,77.5 136.5,-1.5 -1.39,-1.5
GNDMOT
  Bottom 1: 11.5,13.5 11.5,4 12,3.5 13,3.5 8.5V_IN.1 | 11.5,13.5 11.5,16.5 12,17 12,29 14,31 15,31 C2.- | 11.5,13.5 16,13.5 20.5,18 25.5,18 35,27.5 37,27.5 42,32.5 42,35 56.5,49.5 63,49.5 72,58.5 91.5,58.5 96.5,53.5 101.5,53.5 102.5,52.5 103,52.5 A4988_PINS2.7
MS1
  Bottom 0.3: A4988_PINS1.2 90.5,52 91.5,51 107.5,51 109,49.5 109.5,50 MS1.1
MS2
  Bottom 0.3: A4988_PINS1.3 90.5,49.5 91.5,48.5 105,48.5 109,44.5 109.5,45 MS2.1
MS3
  Bottom 0.3: A4988_PINS1.4 90.5,47.5 100,47.5 101.5,46 104.5,46 109.5,41 MS3.1
MS_LEFT  (via drill 0.35)
  Top 0.3: v20.5,16.5 19.5,16.5 11,25 11,31.5 5.5,37 MSWITCH_LEFT.2 | MSWITCH_RIGHT_INDICATOR.K 130.5,42.5 91,3 51,3 v50.5,3.5
  Bottom 0.3: 44,7 44,5.5 ARDUINO_NANO_PINS2.6 | 44,7 33,18 27,18 26,17 21,17 v20.5,16.5 | v50.5,3.5 48.5,3.5 48,4 48,6.5 47,7.5 44.5,7.5 44,7
MS_RIGHT  (via drill 0.35)
  Top 0.3: v19,15 19,16 10.5,24.5 10.5,29 7,32.5 4,32.5 2.5,34 2.5,41.5 5,44 MSWITCH_LEFT_INDICATOR.K | v39.5,3.5 40.5,2.5 94.5,2.5 128.5,36.5 130,36.5 MSWITCH_RIGHT.2
  Bottom 0.3: v19,15 30.5,3.5 v39.5,3.5 45,3.5 46,4.5 46,5.5 ARDUINO_NANO_PINS2.7
N1
  Bottom 0.3: PRINTHEAD.2 16.5,52 17,52 19,54 24.5,54 25,53.5 25.5,54 ULN1.18
N12  (via drill 0.35)
  Top 0.3: v55.5,52 60.5,52 65,47.5 65.5,47.5 66,47 ULN2.15
  Bottom 0.3: PRINTHEAD.13 15,38 12,41 12,55 17,60 27.5,60 28.5,61 40.5,61 43.5,58 48.5,58 54.5,52 v55.5,52
N$2
  Top 0.3: R16.2 35,57.5 44,66.5 59.5,66.5 66.5,59.5 67.5,59.5 EM_STOP.A 67.5,59 68.5,59 71.5,56 79,56 T1.C
N$3
  Top 0.3: T1.B 82,56 83,57 83,57.5 88.5,63 111,63 120,54 121,54 121.5,54.5 121.5,55 122,55 R17.1
N$9
  Top 0.3: R15.2 31,65.5 31.5,65.5 32,66 34,66 34.5,65.5 34.5,65 35,65 R16.1
N$13
  Top 1.5: BATTERY_IN.2 127,6.5 126.38,5.88 123.5,8.75 123.5,12 124,12.5 126,12.5 D3.A
N$17
  Top 0.3: 5V_SUPPLY.1 4.5,4 4.5,18 10,23.5 10,27 9.5,27.5 9,27.5 9,28 D2.A
N$18
  Bottom 0.3: PRINTHEAD.3 17,50.5 18.5,52 26.5,52 27.5,53 27.5,54 ULN1.17
N$19
  Bottom 0.3: PRINTHEAD.4 16.5,49.5 17,49.5 19,51.5 28.5,51.5 31,54 ULN1.16
N$20
  Top 0.3: PRINTHEAD.5 15,48 14,49 14,53 17.5,56.5 30.5,56.5 33,54 ULN1.15
N$21
  Top 0.3: PRINTHEAD.6 16,47 15,47 13.5,48.5 13.5,53.5 19,59 31.5,59 34.5,56 35,56 35.5,55.5 35.5,54.5 ULN1.14
N$22  (via drill 0.35)
  Top 0.3: PRINTHEAD.7 17,45.5 22.5,51 v35,51
  Bottom 0.3: v35,51 37.5,53.5 38,53.5 38.5,54 ULN1.13
N$23  (via drill 0.35)
  Top 0.3: v37.5,51 36.5,50 22.5,50 17,44.5 16.5,44.5 PRINTHEAD.8
  Bottom 0.3: v37.5,51 40,53.5 40.5,53.5 41,54 ULN1.12
N$24
  Bottom 0.3: PRINTHEAD.9 15,43 14,44 14,53 19,58 29.5,58 30.5,59 38.5,59 42.5,55 43,55 43.5,54.5 ULN1.11
N$25  (via drill 0.35)
  Top 0.3: v53.5,50 57,46.5 58,46.5 ULN2.18
  Bottom 0.3: v53.5,50 47,56.5 42,56.5 39,59.5 30,59.5 29,58.5 18.5,58.5 13.5,53.5 13.5,43.5 15,42 16,42 PRINTHEAD.10
N$26  (via drill 0.35)
  Top 0.3: v53.5,51 55.5,49 58.5,49 60,47.5 60.5,47.5 61,47 ULN2.17
  Bottom 0.3: PRINTHEAD.11 15,40.5 13,42.5 13,54 18,59 28.5,59 29.5,60 39.5,60 42.5,57 47.5,57 v53.5,51
N$27  (via drill 0.35)
  Top 0.3: v54.5,51 59,51 62.5,47.5 63,47.5 63.5,47 ULN2.16
  Bottom 0.3: v54.5,51 48,57.5 43,57.5 40,60.5 29,60.5 28,59.5 17.5,59.5 12.5,54.5 12.5,42 15,39.5 16,39.5 PRINTHEAD.12
N$28
  Top 1: 8.5V_IN.2 16,3.5 17,3.5 26.5,13 26.5,14 27,14.5 27,15.5 D1.A
N$29
  Bottom 0.3: R13.1 9.5,43 9.5,43.5 6.5,46.5 6,46.5 5.5,47 5.5,47.5 5,48 MSWITCH_LEFT_INDICATOR.A
N$30
  Top 0.3: R14.1 122,44 125.5,47.5 130.5,47.5 MSWITCH_RIGHT_INDICATOR.A
N$31
  Bottom 1.5: 20V_IN-.1 129.5,17 129.5,7 BATTERY_IN.1
N$32
  Top 0.3: PRINTHEAD.1 17,53 18,52 44,52 44.5,52.5 44.5,53.5 45.5,54.5 ULN1.10 46,54 52.5,54 54,52.5 55.5,54 C1.+ 56,53.5 72,53.5 78.5,47 ULN2.10 78.5,46.5 79.5,46.5 80,46 80,38 77.5,35.5 77.5,7 75.5,5 20V_OUT+.1
N$33
  Top 1.5: D3.C 126,25.5 123.5,25.5 121,23 121,5.5 120.5,5 20V_IN+.1
VMOT
  Bottom 1: 19.75,30.25 20,30 20,27.5 14.5,22 14.5,17 14,16.5 14,15.5 D1.C | 19.75,30.25 19.5,30.5 19,30.5 C2.+ | A4988_PINS2.8 103,55 103,56 97.5,61.5 66.5,61.5 40,35 28,35 23.5,30.5 20,30.5 19.75,30.25

### Text on the board
tNames: Microswitch / Status LED | Scriba Robot Printhead Control Board | EN | VMOT | COM | N1 | Microswitch / Status LED | A4988 | Contacts for HP 51604A / or HP C6602 printhead | Microstep Selections / Jumpers | N12 | DIR | GND | Set power supply voltage according to pulse length / Check documentation for additional information / Risk of burning printhead nozzles! | Check pins intented use first | 3V3 | 5V | D5 | GND | D12 | TX | 20V POWER SUPPLY | ARDUINO NANO | Don't forget to unplug battery power / supply when uploading Arduino program! / Risk of burning printhead nozzles! | D13 | VIN
bNames: Scriba Robot Printhead Control Board / PCB by Robin Baran / Revision 1 (07/2019)